# EAGLE schematic RMXU_V11 (EAGLE 6.2)
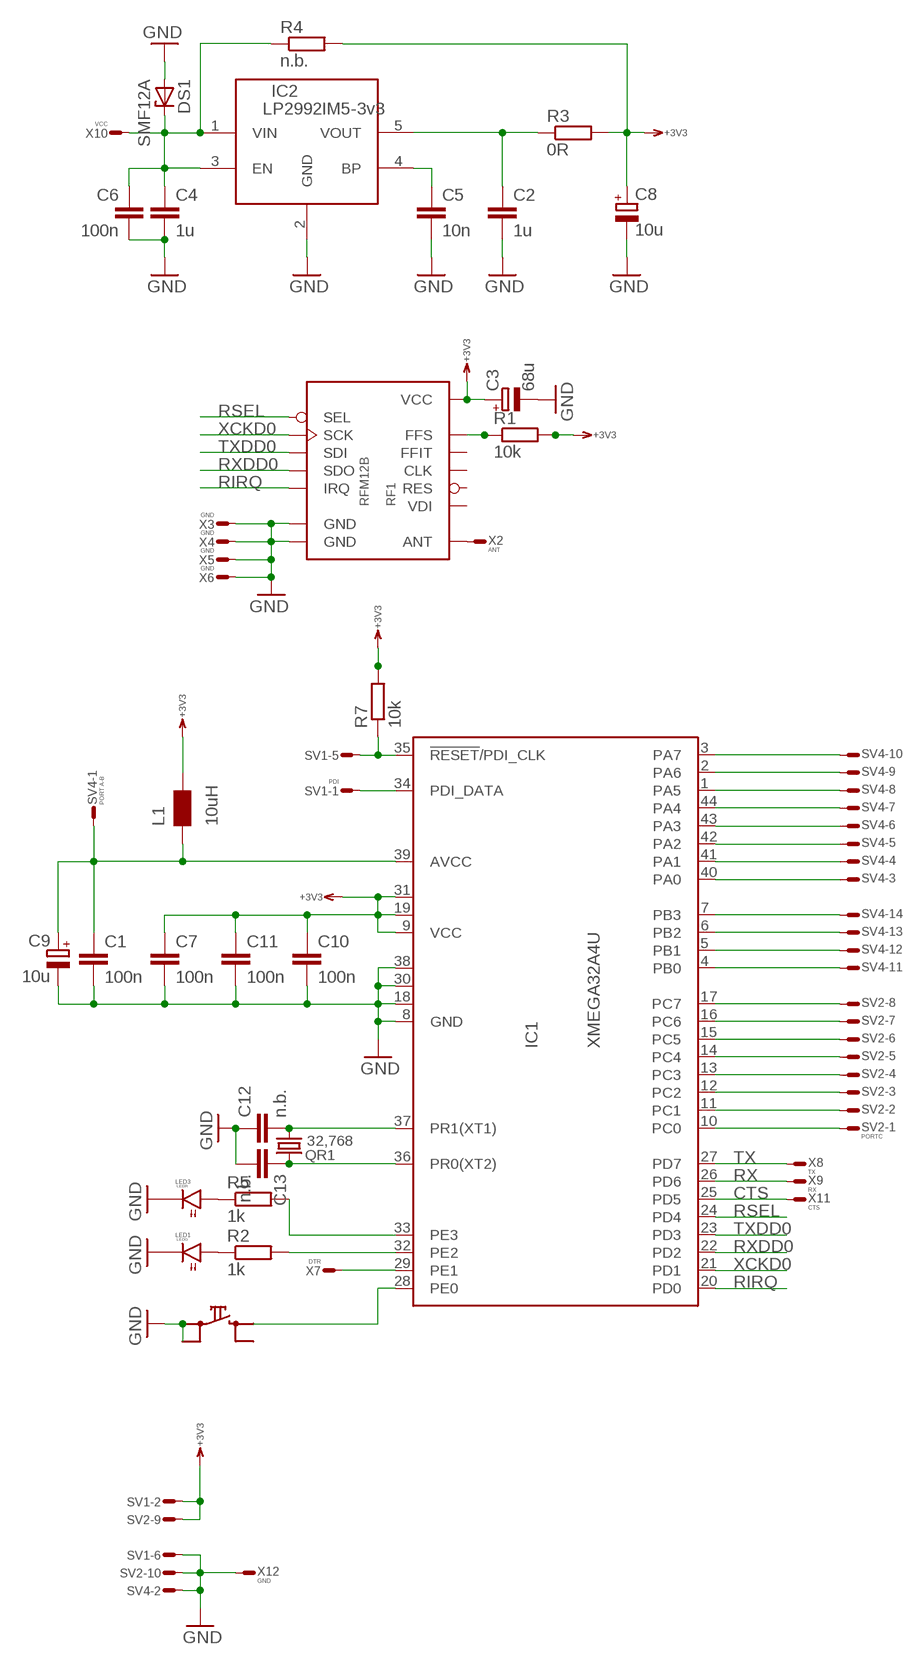
[diagram p0: schematic, sheet 1]

## Parts
C1  100n  C0603  [0603]
C2  1u  C0603  [0603]
C3  68u  C_POLSMCB  [SMC_B]
C4  1u  C0603  [0603]
C5  10n  C0603  [0603]
C6  100n  C0603  [0603]
C7  100n  C0603  [0603]
C8  10u  C_POLSMCA  [SMC_A]
C9  10u  C_POLSMCA  [SMC_A]
C10  100n  C0603  [0603]
C11  100n  C0603  [0603]
C12  n.b.  C0603  [0603]
C13  n.b.  C0603  [0603]
DS1  SMF12A  TVS-DSMF  [SMF]
IC1  XMEGA32A4U  XMEGA16A4A  [TQFP44]
IC2  LP2992IM5-3v3  LDO  [SOT23-5]
L1  10uH  L0805  [0805]
LED1  LEDG  LED1206  [1206]
LED3  LEDR  LED1206  [1206]
QR1  32,768  Q26H  [TC26H]
R1  10k  R0603  [0603]
R2  1k  R0603  [0603]
R3  0R  R0603  [0603]
R4  n.b.  R0603  [0603]
R5  1k  R0603  [0603]
R7  10k  R0603  [0603]
RF1  RFM12B  RFM12B-868-S1  [RFM12B]
SV1  PDI  ML6E  [ML6]
SV2  PORTC  ML10E  [ML10]
SV4  PORT A-B  ML14E  [ML14]
SW1  SW1  SPNO  [SPNO]
X2  ANT  WIREPADT2.0/1.2  [T2.0/1.2]
X3  GND  WIREPADT2.3/1.5  [T2.3/1.5]
X4  GND  WIREPADT2.3/1.5  [T2.3/1.5]
X5  GND  WIREPADT2.3/1.5  [T2.3/1.5]
X6  GND  WIREPADT2.3/1.5  [T2.3/1.5]
X7  DTR  WIREPADT1.4/0.7L  [T1.4/0.7L]
X8  TX  WIREPADT1.4/0.7L  [T1.4/0.7L]
X9  RX  WIREPADT1.4/0.7L  [T1.4/0.7L]
X10  VCC  WIREPADT1.4/0.7L  [T1.4/0.7L]
X11  CTS  WIREPADT1.4/0.7L  [T1.4/0.7L]
X12  GND  WIREPADT1.4/0.7L  [T1.4/0.7L]

## Nets
+3V3: C3.+ C7.1 C8.+ C10.1 C11.1 IC1.9(VCC) IC1.19(VCC1) IC1.31(VCC2) L1.2 R1.2 R3.2 R4.2 R7.2 RF1.VDD(VCC) SV1.2 SV2.9
CTS: IC1.25(PD5) X11.1(S)
DTR: IC1.32(PE2) R2.2
GND: C1.2 C2.2 C3.- C4.2 C5.2 C6.2 C7.2 C8.- C9.- C10.2 C11.2 C12.1 C13.2 DS1.A IC1.8(GND) IC1.18(GND1) IC1.30(GND2) IC1.38(GND3) IC2.2(GND) LED1.2(C) LED3.2(C) RF1.GND RF1.GND@1(GND) SV1.6 SV2.10 SV4.2 SW1.1(1.1) SW1.2(1.2) X3.P$1(S) X4.P$1(S) X5.P$1(S) X6.P$1(S) X12.1(S)
N$1: IC1.10(PC0) SV2.1
N$2: IC1.11(PC1) SV2.2
N$3: IC1.12(PC2) SV2.3
N$4: IC1.29(PE1) X7.1(S)
N$5: C12.2 IC1.37(PR1(XT1)) QR1.1
N$6: IC1.13(PC3) SV2.4
N$7: IC1.14(PC4) SV2.5
N$8: IC1.15(PC5) SV2.6
N$9: IC1.16(PC6) SV2.7
N$10: IC1.17(PC7) SV2.8
N$11: RF1.ANT X2.P$1(S)
N$12: IC1.33(PE3) R5.2
N$13: C5.1 IC2.4(BP)
N$14: IC1.28(PE0) SW1.3(2.1)
N$15: LED1.1(A) R2.1
N$16: C13.1 IC1.36(PR0(XT2)) QR1.2
N$17: C2.1 IC2.5(VOUT) R3.1
N$18: R1.1 RF1.FFS
N$20: LED3.1(A) R5.1
N$21: C1.1 C9.+ IC1.39(AVCC) L1.1 SV4.1
N$23: IC1.7(PB3) SV4.14
N$24: IC1.6(PB2) SV4.13
N$25: IC1.5(PB1) SV4.12
N$26: IC1.4(PB0) SV4.11
N$27: IC1.3(PA7) SV4.10
N$28: IC1.2(PA6) SV4.9
N$29: IC1.1(PA5) SV4.8
N$30: IC1.44(PA4) SV4.7
N$31: IC1.43(PA3) SV4.6
N$32: IC1.42(PA2) SV4.5
N$34: IC1.41(PA1) SV4.4
N$35: IC1.40(PA0) SV4.3
N$40: IC1.34(PDI_DATA) SV1.1
N$41: IC1.35(!RESET!/PDI_CLK) R7.1 SV1.5
RIRQ: IC1.20(PD0) RF1.IRQ
RSEL: IC1.24(PD4) RF1.SEL
RX: IC1.26(PD6) X9.1(S)
RXDD0: IC1.22(PD2) RF1.SDO
TX: IC1.27(PD7) X8.1(S)
TXDD0: IC1.23(PD3) RF1.SDI
VCC: C4.1 C6.1 DS1.C IC2.1(VIN) IC2.3(EN) R4.1 X10.1(S)
XCKD0: IC1.21(PD1) RF1.SCK
Unconnected: RF1./RES(RES) RF1.CFIL(FFIT) RF1.CLK RF1.INT(VDI) SV1.3 SV1.4 SW1.4(2.2)

## Library data of the parts
C1 C2 C4-C7 C10-C13 = RCL:C: Capacitor SMD
C3 C8 C9 = RCL:C_POL: POLARIZED CAPACITOR, European symbol
DS1 = Diode:TVS-D: DIODE
IC1 = atmel:XMEGA16A4: MICROCONTROLLER Features High-performance, Low-power 8/16-bit AVR XMEGA Microcontroller Non-Volatile Program and Data Memories - 16 KB - 128 KB of In-System Self-Programmable Flash - 4 KB - 8 KB Boot Code Section with Independent Lock Bits - 1 KB - 2 KB EEPROM - 2 KB - 8 KB Internal SRAM Peripheral Features - Four-channel DMA Controller with support for external requests - Eight-channel Event System - Five 16-bit Timer/Counters Three Timer/Counters with 4 Output Compare or Input Capture channels Two Timer/Counters with 2 Output Compare or Input Capture channels High-Resolution Extensions on all Timer/Counters Advanced Waveform Extension on one Timer/Counter - Five USARTs IrDA Extension on one USART - Two Two-Wire Interfaces with dual address match (I2C and SMBus compatible) - Two SPIs (Serial Peripheral Interfaces) peripherals - AES and DES Crypto Engine - 16-bit Real Time Counter with Separate Oscillator - One Twelve-channel, 12-bit, 2 Msps Analog to Digital Converter - One Two-channel, 12-bit, 1 Msps Digital to Analog Converter - Two Analog Comparators with Window compare function - External Interrupts on all General Purpose I/O pins - Programmable Watchdog Timer with Separate On-chip Ultra Low Power Oscillator Special Microcontroller Features - Power-on Reset and Programmable Brown-out Detection - Internal and External Clock Options with PLL - Programmable Multi-level Interrupt Controller - Sleep Modes: Idle, Power-down, Standby, Power-save, Extended Standby - Advanced Programming, Test and Debugging Interfaces PDI (Program and Debug Interface) for programming, test and debugging I/O and Packages - 34 Programmable I/O Lines - 44 - lead TQFP - 44 - pad VQFN/QFN - 49 - ball VFBGA Operating Voltage - 1.6 - 3.6V Speed performance - 0 - 12 MHz @ 1.6 - 3.6V - 0 - 32 MHz @ 2.7 - 3.6V Drawn by Dipl.-Ing. (FH) Robert Siegler Created: 27.05.09
IC2 = DCDC:LDO
L1 = RCL:L
LED1 LED3 = Optic:LED
QR1 = QUARTZ:Q
R1-R5 R7 = RCL:R: Resistor SMD
RF1 = RF:RFM12B: 5dB Transceiver Module
SV1 = Conn:ML6E: HARTING
SV2 = Conn:ML10?E: HARTING
SV4 = Conn:ML14?E: HARTING
SW1 = Relay_Switch:SPNO
X2-X12 = Conn:WIREPAD: Wire PAD connect wire on PCB